# Altium project LS1.PrjPCB
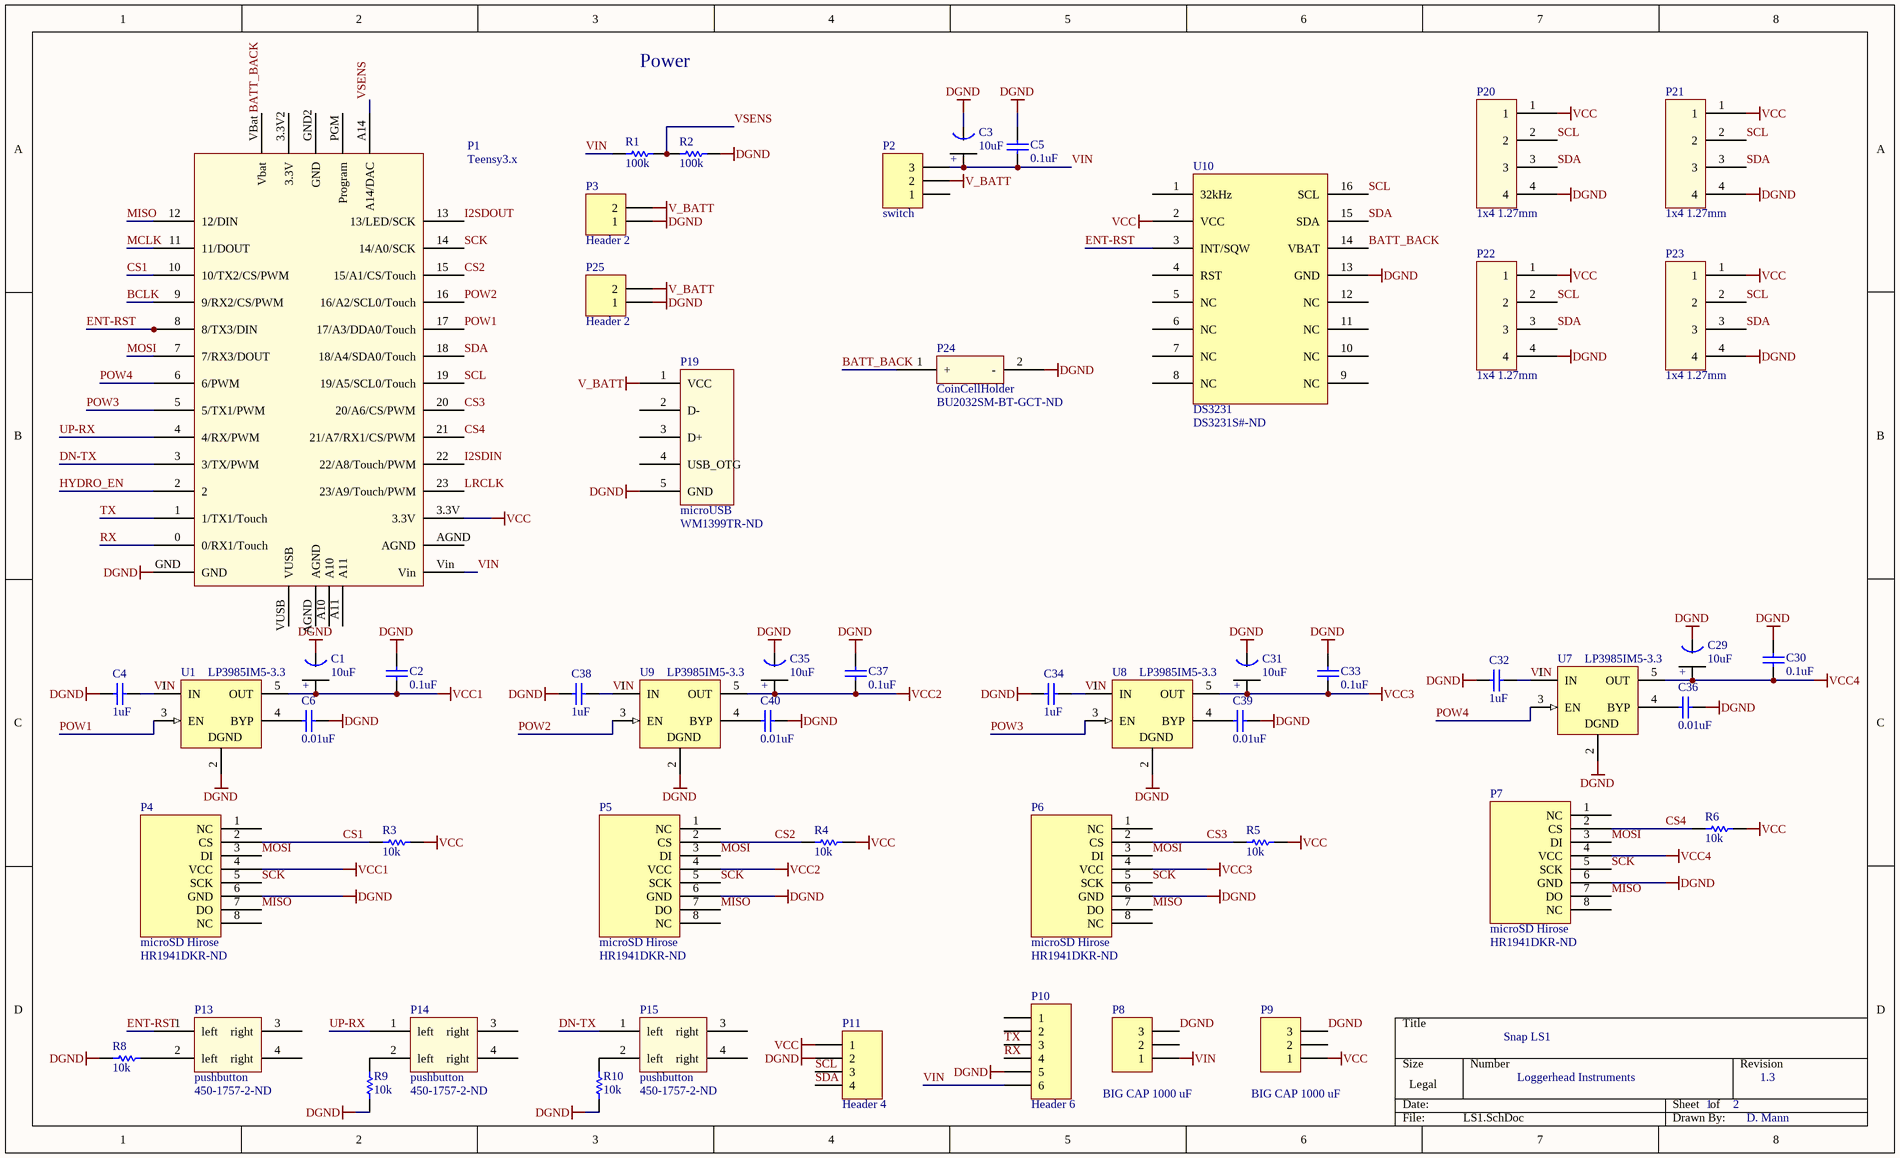
[diagram p0: LS1.SchDoc]
2 sheets, 89 parts. Net scope: global (net labels, ports and power ports of the same name join across sheets).
Board file: LS1.PcbDoc
Sheets:
  LS1.SchDoc
  LS1_audio.SchDoc

## Sheet LS1.SchDoc
size Legal

### Parts
C1  10uF  [Tant0805]
C2  0.1uF  [0402]
C3  10uF  [Tant0805]
C4  1uF  [0402]
C5  0.1uF  [0402]
C6  0.01uF  [0402]
C29  10uF  [Tant0805]
C30  0.1uF  [0402]
C31  10uF  [Tant0805]
C32  1uF  [0402]
C33  0.1uF  [0402]
C34  1uF  [0402]
C35  10uF  [Tant0805]
C36  0.01uF  [0402]
C37  0.1uF  [0402]
C38  1uF  [0402]
C39  0.01uF  [0402]
C40  0.01uF  [0402]
P1  Teensy3.x  [Teensy3.x]
P2  switch  [HDR1X3]
P3  Header 2  [HDR1X2]
P4  microSD Hirose  Supplier Part Number 1: HR1941DKR-ND  [DM3D microSD]
P5  microSD Hirose  Supplier Part Number 1: HR1941DKR-ND  [DM3D microSD]
P6  microSD Hirose  Supplier Part Number 1: HR1941DKR-ND  [DM3D microSD]
P7  microSD Hirose  Supplier Part Number 1: HR1941DKR-ND  [DM3D microSD]
P8  BIG CAP 1000 uF  [HDR1X3]
P9  BIG CAP 1000 uF  [HDR1X3]
P10  Header 6  [HDR1X6]
P11  Header 4  [HDR1X4]
P13  pushbutton  Supplier Part Number 1: 450-1757-2-ND  [SOP4]
P14  pushbutton  Supplier Part Number 1: 450-1757-2-ND  [SOP4]
P15  pushbutton  Supplier Part Number 1: 450-1757-2-ND  [SOP4]
P19  microUSB  Supplier Part Number 1: WM1399TR-ND  [microUSB-B]
P20  1x4 1.27mm  [Header1x4 1.27mm]
P21  1x4 1.27mm  [Header1x4 1.27mm]
P22  1x4 1.27mm  [Header1x4 1.27mm]
P23  1x4 1.27mm  [Header1x4 1.27mm]
P24  CoinCellHolder  Supplier Part Number 1: BU2032SM-BT-GCT-ND  [CoinCellHolder]
P25  Header 2  [HDR1X2]
R1  100k  [3-0603]
R2  100k  [3-0603]
R3  10k  [3-0603]
R4  10k  [3-0603]
R5  10k  [3-0603]
R6  10k  [3-0603]
R8  10k  [3-0603]
R9  10k  [3-0603]
R10  10k  [3-0603]
U1  LP3985IM5-3.3  [MF05A_N]
U7  LP3985IM5-3.3  [MF05A_N]
U8  LP3985IM5-3.3  [MF05A_N]
U9  LP3985IM5-3.3  [MF05A_N]
U10  DS3231  Supplier Part Number 1: DS3231S#-ND  [DS3231]

### Nets
DGND: C1.1(GND) C2.2 C3.1(GND) C4.2 C5.2 C6.2 C29.1(GND) C30.2 C31.1(GND) C32.2 C33.2 C34.2 C35.1(GND) C36.2 C37.2 C38.2 C39.2 C40.2 P1.GND P3.1 P4.6(GND) P5.6(GND) P6.6(GND) P7.6(GND) P8.3 P9.3 P10.5 P11.2 P19.5(GND) P20.4 P21.4 P22.4 P23.4 P24.2(-) P25.1 R2.1 R8.2 R9.2 R10.2 U1.2(GND) U7.2(GND) U8.2(GND) U9.2(GND) U10.13(GND)
V_BATT: P2.2 P3.2 P19.1(VCC) P25.2
VCC: P1.3.3V P9.1 P11.1 P20.1 P21.1 P22.1 P23.1 R3.1 R4.1 R5.1 R6.1 U10.2(VCC)
VCC1: C1.2(+) C2.1 P4.4(VCC) U1.5(OUT)
VCC2: C35.2(+) C37.1 P5.4(VCC) U9.5(OUT)
VCC3: C31.2(+) C33.1 P6.4(VCC) U8.5(OUT)
VCC4: C29.2(+) C30.1 P7.4(VCC) U7.5(OUT)
VIN: C3.2(+) C4.1 C5.1 C32.1 C34.1 C38.1 P1.Vin P2.3 P8.1 P10.6 R1.2 U1.1(IN) U7.1(IN) U8.1(IN) U9.1(IN)
BATT_BACK: P1.VBat(Vbat) P24.1(+) U10.14(VBAT)
BCLK: P1.9(9/RX2/CS/PWM)
CS1: P1.10(10/TX2/CS/PWM) P4.2(CS) R3.2
CS2: P1.15(15/A1/CS/Touch) P5.2(CS) R4.2
CS3: P1.20(20/A6/CS/PWM) P6.2(CS) R5.2
CS4: P1.21(21/A7/RX1/CS/PWM) P7.2(CS) R6.2
DN-TX: P1.3(3/TX/PWM) P15.1(left)
ENT-RST: P1.8(8/TX3/DIN) P13.1(left) U10.3(INT/SQW)
HYDRO_EN: P1.2
I2SDIN: P1.22(22/A8/Touch/PWM)
I2SDOUT: P1.13(13/LED/SCK)
LRCLK: P1.23(23/A9/Touch/PWM)
MCLK: P1.11(11/DOUT)
MISO: P1.12(12/DIN) P4.7(DO) P5.7(DO) P6.7(DO) P7.7(DO)
MOSI: P1.7(7/RX3/DOUT) P4.3(DI) P5.3(DI) P6.3(DI) P7.3(DI)
POW1: P1.17(17/A3/DDA0/Touch) U1.3(EN)
POW2: P1.16(16/A2/SCL0/Touch) U9.3(EN)
POW3: P1.5(5/TX1/PWM) U8.3(EN)
POW4: P1.6(6/PWM) U7.3(EN)
RX: P1.0(0/RX1/Touch) P10.4
SCK: P1.14(14/A0/SCK) P4.5(SCK) P5.5(SCK) P6.5(SCK) P7.5(SCK)
SCL: P1.19(19/A5/SCL0/Touch) P11.3 P20.2 P21.2 P22.2 P23.2 U10.16(SCL)
SDA: P1.18(18/A4/SDA0/Touch) P11.4 P20.3 P21.3 P22.3 P23.3 U10.15(SDA)
TX: P1.1(1/TX1/Touch) P10.3
UP-RX: P1.4(4/RX/PWM) P14.1(left)
VSENS: P1.A14(A14/DAC) R1.1 R2.2
NetC6_1: C6.1 U1.4(BYP)
NetC36_1: C36.1 U7.4(BYP)
NetC39_1: C39.1 U8.4(BYP)
NetC40_1: C40.1 U9.4(BYP)
NetP13_2: P13.2(left) R8.1
NetP14_2: P14.2(left) R9.1
NetP15_2: P15.2(left) R10.1

Not connected (* = marked no-connect by the designer): P1 3.3V2(3.3V) A10 A11 AGND GND2(GND) PGM(Program) VUSB; P2 1; P4 1(NC) 8(NC); P5 1(NC) 8(NC); P6 1(NC) 8(NC); P7 1(NC) 8(NC); P8 2; P9 2; P10 1 2; P13 3(right) 4(right); P14 3(right) 4(right); P15 3(right) 4(right); P19 2(D-) 3(D+) 4(USB_OTG); U10 1(32kHz) 4(RST) 5(NC) 6(NC) 7(NC) 8(NC) 9(NC) 10(NC) 11(NC) 12(NC)

### Notes on the sheet
- Power
- Snap LS1
- Loggerhead Instruments
- 1
- 2
- 1.3
- D. Mann
- (in symbol LP3985IM5-3.3) DGND

### Library data of the parts
C1 C3 C29 C31 C35 = Tant0805: Value: 10uF
C2 C5 C30 C33 C37 = C0402: Ceramic Chip Capacitor - Standard; Note: Footprint corresponds to dimensions for bulk cassette packaging. This case size has tightened tolerances.; Published: 17-Jul-2002; LatestRevisionDate: 19-Mar-2004; LatestRevisionNote: Silkscreen size reduced.; DatasheetDocument: Mar-2001; PackageDocument: Mar-2001; PackageReference: 0402; Publisher: Altium Limited; Code_JEITA: 0402; Code_IPC: 1005 [0402]; ComponentLink1Description: Manufacturer Link; ComponentLink1URL: http://www.kemet.com/; ComponentLink2Description: Datasheet; ComponentLink2URL: http://www.kemet.com/kemet/web/homepage/kechome.nsf/vapubfilesname/F3102TA.pdf/$file/F3102TA.pdf; Value: 0.1uF
C4 C6 C32 C34 C36 C38-C40 = C0402: Ceramic Chip Capacitor - Standard; Note: Footprint corresponds to dimensions for bulk cassette packaging. This case size has tightened tolerances.; Value: 0.1uF; Published: 17-Jul-2002; LatestRevisionDate: 19-Mar-2004; LatestRevisionNote: Silkscreen size reduced.; DatasheetDocument: Mar-2001; PackageDocument: Mar-2001; PackageReference: 0402; Publisher: Altium Limited; Code_JEITA: 0402; Code_IPC: 1005 [0402]; ComponentLink1Description: Manufacturer Link; ComponentLink1URL: http://www.kemet.com/; ComponentLink2Description: Datasheet; ComponentLink2URL: http://www.kemet.com/kemet/web/homepage/kechome.nsf/vapubfilesname/F3102TA.pdf/$file/F3102TA.pdf
P2 P8 P9 = Header 3: Header, 3-Pin; LatestRevisionDate: 17-Jul-2002; LatestRevisionNote: Re-released for DXP Platform.; Publisher: Altium Limited
P3 P25 = Header 2: Header, 2-Pin; LatestRevisionDate: 17-Jul-2002; LatestRevisionNote: Re-released for DXP Platform.; Publisher: Altium Limited
P10 = Header 6: Header, 6-Pin; LatestRevisionDate: 17-Jul-2002; LatestRevisionNote: Re-released for DXP Platform.; Publisher: Altium Limited
P11 = Header 4: Header, 4-Pin; LatestRevisionDate: 17-Jul-2002; LatestRevisionNote: Re-released for DXP Platform.; Publisher: Altium Limited
P19 = microUSB-B: Supplier 1: Digi-Key
P20-P23 = Header 1x4 1.27mm
R1-R6 R8-R10 = ERJ3RK: Precision Thick Film Chip Resistor, 10 Ohm to 1M Ohm Range, 1% and 0.5% Tolerance, 0603 Size, 0.063 W; Published: 17-Dec-2003; LatestRevisionDate: 19-Mar-2004; LatestRevisionNote: Silkscreen size reduced.; PackageDocument: Mar-2003; PackageReference: 3-0603; Publisher: Altium Limited; Code_IPC: 1608 [0603]; ComponentLink1Description: Manufacturer Link; ComponentLink1URL: http://www.panasonic.com/industrial/components/resistive_products.htm; ComponentLink2Description: Datasheet; ComponentLink2URL: http://www.panasonic.com/industrial/components/pdf/AOA0000CE2.pdf
U1 U7-U9 = LP3985IM5-3.3: Micropower, 150mA Low-Noise Ultra Low-Dropout CMOS Voltage Regulator; Manufacturer: National Semiconductor; CompType: LDO IC; PackageTopMarking: LDQB*XTT; PowerWise: N; Published: 4-Dec-2008; DatasheetVersion: Aug-2005; PackageVersion: revD, Aug-2008; PackageReference: MF05A; Publisher: Altium Limited; PackageDescription: Molded SOT-23, .115 x .063 x .040 in Body, 5 Lead, .0375 in Pitch; PartNumber: LP3985IM5-3.3; RoHS: O; PinCount: 5; DigiKeyPartNumber: LP3985IM5-3.3CT-ND; ComponentLink1Description: LP3985 Datasheet; ComponentLink1URL: http://www.national.com/ds/LP/LP3985.pdf; ComponentLink2Description: LP3985 Web Page; ComponentLink2URL: http://www.national.com/pf/LP/LP3985.html; ComponentLink3Description: MF05A Package Page; ComponentLink3URL: http://www.national.com/packaging/folders/mf05a.html
P4-P7 = microSD Hirose: Supplier 1: Digi-Key
P13-P15 = pushbutton: Supplier 1: Digi-Key
P24 = CoinCellHolder: Supplier 1: Digi-Key
U10 = DS3231: Supplier 1: Digi-Key

## Sheet LS1_audio.SchDoc
size A
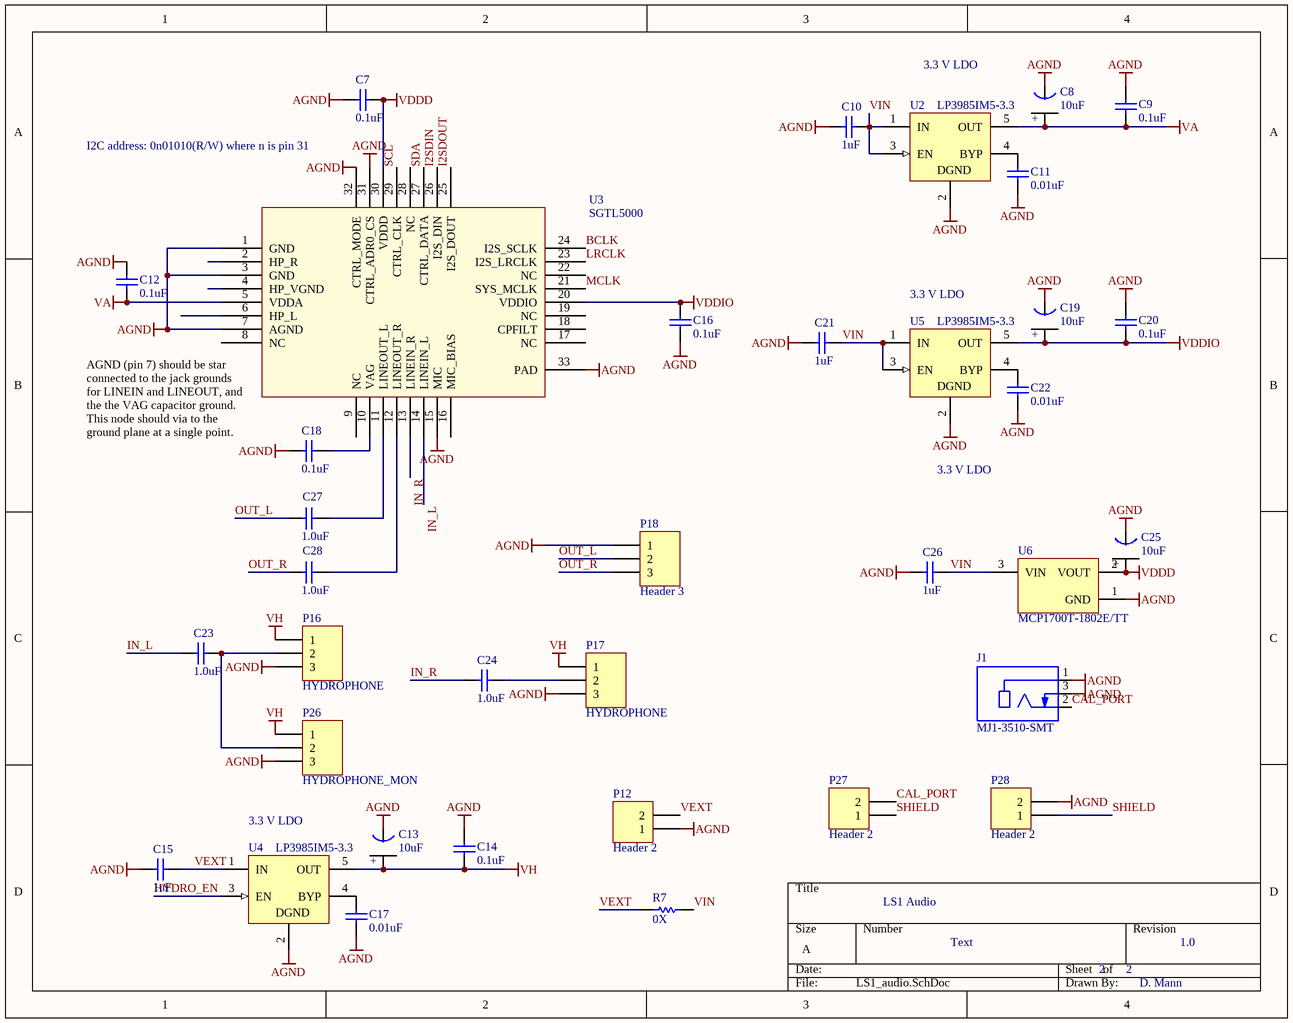
[diagram p1: LS1_audio.SchDoc]

### Parts
C7  0.1uF  [0402]
C8  10uF  [Tant0805]
C9  0.1uF  [0402]
C10  1uF  [0402]
C11  0.01uF  [0402]
C12  0.1uF  [0402]
C13  10uF  [Tant0805]
C14  0.1uF  [0402]
C15  1uF  [0402]
C16  0.1uF  [0402]
C17  0.01uF  [0402]
C18  0.1uF  [0402]
C19  10uF  [Tant0805]
C20  0.1uF  [0402]
C21  1uF  [0402]
C22  0.01uF  [0402]
C23  1.0uF  [0402]
C24  1.0uF  [0402]
C25  10uF  [Tant0805]
C26  1uF  [0402]
C27  1.0uF  [0402]
C28  1.0uF  [0402]
J1  MJ1-3510-SMT  [CUI_MJ1-3510-SMT]
P12  Header 2  [HDR1X2]
P16  HYDROPHONE  [HDR1X3]
P17  HYDROPHONE  [HDR1X3]
P18  Header 3  [HDR1X3]
P26  HYDROPHONE_MON  [HDR1X3]
P27  Header 2  [HDR1X2]
P28  Header 2  [HDR1X2]
R7  0X  [3-0603]
U2  LP3985IM5-3.3  [MF05A_N]
U3  SGTL5000  [QFN32]
U4  LP3985IM5-3.3  [MF05A_N]
U5  LP3985IM5-3.3  [MF05A_N]
U6  MCP1700T-1802E/TT  [SOT-23-TT3_N]

### Nets
AGND: C7.2 C8.1(GND) C9.2 C10.2 C11.2 C12.2 C13.1(GND) C14.2 C15.2 C16.2 C17.2 C18.2 C19.1(GND) C20.2 C21.2 C22.2 C25.1(GND) C26.2 J1.1 J1.3 P12.1 P16.3 P17.3 P18.1 P26.3 P28.2 U2.2(GND) U3.1(GND) U3.3(GND) U3.7(AGND) U3.15(MIC) U3.31(CTRL_ADR0_CS) U3.32(CTRL_MODE) U3.33(PAD) U4.2(GND) U5.2(GND) U6.1(GND)
VA: C8.2(+) C9.1 C12.1 U2.5(OUT) U3.5(VDDA)
VDDD: C7.1 C25.2(+) U3.30(VDDD) U6.2(VOUT)
VDDIO: C16.1 C19.2(+) C20.1 U3.20(VDDIO) U5.5(OUT)
VH: C13.2(+) C14.1 P16.1 P17.1 P26.1 U4.5(OUT)
VIN: C10.1 C21.1 C26.1 R7.1 U2.1(IN) U2.3(EN) U5.1(IN) U5.3(EN) U6.3(VIN)
BCLK: U3.24(I2S_SCLK)
CAL_PORT: J1.2 P27.2
HYDRO_EN: U4.3(EN)
I2SDIN: U3.26(I2S_DIN)
I2SDOUT: U3.25(I2S_DOUT)
IN_L: C23.2 U3.14(LINEIN_L)
IN_R: C24.2 U3.13(LINEIN_R)
LRCLK: U3.23(I2S_LRCLK)
MCLK: U3.21(SYS_MCLK)
OUT_L: C27.1 P18.2
OUT_R: C28.1 P18.3
SCL: U3.29(CTRL_CLK)
SDA: U3.27(CTRL_DATA)
SHIELD: P27.1 P28.1
VEXT: C15.1 P12.2 R7.2 U4.1(IN)
NetC11_1: C11.1 U2.4(BYP)
NetC17_1: C17.1 U4.4(BYP)
NetC18_1: C18.1 U3.10(VAG)
NetC22_1: C22.1 U5.4(BYP)
NetC23_1: C23.1 P16.2 P26.2
NetC24_1: C24.1 P17.2
NetC27_2: C27.2 U3.11(LINEOUT_L)
NetC28_2: C28.2 U3.12(LINEOUT_R)

Not connected (* = marked no-connect by the designer): U3 2(HP_R) 4(HP_VGND) 6(HP_L) 8(NC) 9(NC) 16(MIC_BIAS) 17(NC) 18(CPFILT) 19(NC) 22(NC) 28(NC)

### Notes on the sheet
- 3.3 V LDO
- I2C address: 0n01010(R/W) where n is pin 31
- (near U5) 3.3 V LDO
- (near U3) AGND (pin 7) should be star connected to the jack grounds for LINEIN and LINEOUT, and the the VAG capacitor ground. This node should via to the ground plane at a single point.
- LS1 Audio
- Text
- 2
- 1.0
- D. Mann
- (in symbol LP3985IM5-3.3) DGND

### Library data of the parts
C7 C9 C12 C14 C16 C18 C20 = C0402: as C2 on sheet LS1; Published: 17-Jul-2002; LatestRevisionDate: 19-Mar-2004; LatestRevisionNote: Silkscreen size reduced.; DatasheetDocument: Mar-2001; PackageDocument: Mar-2001; PackageReference: 0402; Publisher: Altium Limited; Code_JEITA: 0402; Code_IPC: 1005 [0402]; ComponentLink1Description: Manufacturer Link; ComponentLink1URL: http://www.kemet.com/; ComponentLink2Description: Datasheet; ComponentLink2URL: http://www.kemet.com/kemet/web/homepage/kechome.nsf/vapubfilesname/F3102TA.pdf/$file/F3102TA.pdf; Value: 0.1uF
C8 C13 C19 C25 = Tant0805: Value: 10uF
C10 C11 C15 C17 C21-C24 C26-C28 = C0402: as C4 on sheet LS1; Published: 17-Jul-2002; LatestRevisionDate: 19-Mar-2004; LatestRevisionNote: Silkscreen size reduced.; DatasheetDocument: Mar-2001; PackageDocument: Mar-2001; PackageReference: 0402; Publisher: Altium Limited; Code_JEITA: 0402; Code_IPC: 1005 [0402]; ComponentLink1Description: Manufacturer Link; ComponentLink1URL: http://www.kemet.com/; ComponentLink2Description: Datasheet; ComponentLink2URL: http://www.kemet.com/kemet/web/homepage/kechome.nsf/vapubfilesname/F3102TA.pdf/$file/F3102TA.pdf
J1 = MJ1-3510-SMT: 3.5 mm, Mono, Right Angle, Surface Mount (SMT), Audio Jack Connector; MF: {'manufacturer': u'CUI'}; Value: *; Price: None; Availability: Unavailable; Package: None; MP: MJ1-3510-SMT
P12 P27 P28 = Header 2: Header, 2-Pin; LatestRevisionDate: 17-Jul-2002; LatestRevisionNote: Re-released for DXP Platform.; Publisher: Altium Limited
P16-P18 P26 = Header 3: Header, 3-Pin; LatestRevisionDate: 17-Jul-2002; LatestRevisionNote: Re-released for DXP Platform.; Publisher: Altium Limited
R7 = ERJ3RK: as R1 on sheet LS1; Published: 17-Dec-2003; LatestRevisionDate: 19-Mar-2004; LatestRevisionNote: Silkscreen size reduced.; PackageDocument: Mar-2003; PackageReference: 3-0603; Publisher: Altium Limited; Code_IPC: 1608 [0603]; ComponentLink1Description: Manufacturer Link; ComponentLink1URL: http://www.panasonic.com/industrial/components/resistive_products.htm; ComponentLink2Description: Datasheet; ComponentLink2URL: http://www.panasonic.com/industrial/components/pdf/AOA0000CE2.pdf
U2 U4 U5 = LP3985IM5-3.3: as U1 on sheet LS1; Published: 4-Dec-2008; DatasheetVersion: Aug-2005; PackageVersion: revD, Aug-2008; PackageReference: MF05A; Publisher: Altium Limited; PackageDescription: Molded SOT-23, .115 x .063 x .040 in Body, 5 Lead, .0375 in Pitch; PartNumber: LP3985IM5-3.3; RoHS: O; PinCount: 5; DigiKeyPartNumber: LP3985IM5-3.3CT-ND; ComponentLink1Description: LP3985 Datasheet; ComponentLink1URL: http://www.national.com/ds/LP/LP3985.pdf; ComponentLink2Description: LP3985 Web Page; ComponentLink2URL: http://www.national.com/pf/LP/LP3985.html; ComponentLink3Description: MF05A Package Page; ComponentLink3URL: http://www.national.com/packaging/folders/mf05a.html
U6 = MCP1700T-1802E/TT: Low Quiescent Current LDO, 3-Pin SOT-23, Extended Temperature, Tape and Reel; Manufacturer: Microchip; DatasheetVersion: revB, Feb-2007; PackageVersion: revBB, Aug-2009; PackageReference: SOT-23-TT3; PackageDescription: 3-Lead Plastic Small Outline Transistor (TT) [SOT-23]; Supplier 1: Digi-Key; Supplier Part Number 1: MCP1700T1802ETTTR-ND; Supplier 2: Digi-Key; Supplier Part Number 2: MCP1700T1802ETTCT-ND; Supplier 3: Digi-Key; Supplier Part Number 3: MCP1700T1802ETTDKR-ND; Supplier 4: Farnell; Supplier Part Number 4: 1296591RL; Supplier 5: Farnell; Supplier Part Number 5: 1296591; Supplier 6: Newark; Supplier Part Number 6: 84R5175; Supplier 7: Mouser; Supplier Part Number 7: 579-MCP1700T1802E/TT; Mounting Technology: Surface Mount; Code_IPC: SOT23-3; PartNumber: MCP1700T-1802E/TT; ComponentLink1Description: Manufacturer URL; ComponentLink1URL: http://www.microchip.com/; ComponentLink2Description: Datasheet; ComponentLink2URL: http://ww1.microchip.com/downloads/en/DeviceDoc/21826b.pdf; ComponentLink3Description: Package Specification; ComponentLink3URL: http://www.microchip.com/stellent/groups/techpub_sg/documents/packagingspec/en012702.pdf

## Nets that join several sheets
VIN: LS1 (15 pins), LS1_audio (9 pins)
BCLK: LS1 (P1.9), LS1_audio (U3.24)
HYDRO_EN: LS1 (P1.2), LS1_audio (U4.3)
I2SDIN: LS1 (P1.22), LS1_audio (U3.26)
I2SDOUT: LS1 (P1.13), LS1_audio (U3.25)
LRCLK: LS1 (P1.23), LS1_audio (U3.23)
MCLK: LS1 (P1.11), LS1_audio (U3.21)
SCL: LS1 (7 pins), LS1_audio (U3.29)
SDA: LS1 (7 pins), LS1_audio (U3.27)